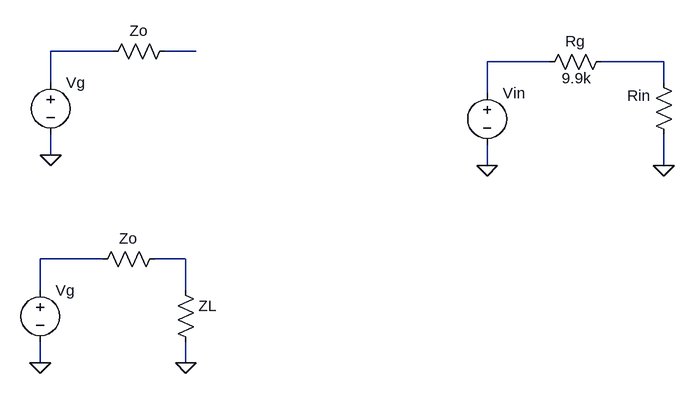
[diagram p0: schematic spice_imagenes.asc]
spice_imagenes.asc, the LTspice schematic file:
Version 4
SHEET 1 1060 680
WIRE 192 48 96 48
WIRE 320 48 272 48
WIRE 864 64 768 64
WIRE 1040 64 944 64
WIRE 96 96 96 48
WIRE 1040 96 1040 64
WIRE 768 112 768 64
WIRE 96 208 96 176
WIRE 768 224 768 192
WIRE 1040 224 1040 176
WIRE 176 368 80 368
WIRE 304 368 256 368
WIRE 80 416 80 368
WIRE 304 416 304 368
WIRE 80 528 80 496
WIRE 304 528 304 496
FLAG 96 208 0
FLAG 80 528 0
FLAG 304 528 0
FLAG 768 224 0
FLAG 1040 224 0
SYMBOL voltage 96 80 R0
WINDOW 123 0 0 Left 0
WINDOW 39 0 0 Left 0
SYMATTR InstName Vg
SYMATTR Value ""
SYMBOL res 288 32 R90
WINDOW 0 0 56 VBottom 2
WINDOW 3 32 56 VTop 2
SYMATTR InstName Zo
SYMATTR Value ""
SYMBOL voltage 80 400 R0
WINDOW 123 0 0 Left 0
WINDOW 39 0 0 Left 0
SYMATTR InstName Vg
SYMATTR Value ""
SYMBOL res 272 352 R90
WINDOW 0 0 56 VBottom 2
WINDOW 3 32 56 VTop 2
SYMATTR InstName Zo
SYMATTR Value ""
SYMBOL res 288 400 R0
SYMATTR InstName ZL
SYMATTR Value ""
SYMBOL voltage 768 96 R0
WINDOW 123 0 0 Left 0
WINDOW 39 0 0 Left 0
SYMATTR InstName Vin
SYMATTR Value ""
SYMBOL res 960 48 R90
WINDOW 0 0 56 VBottom 2
WINDOW 3 57 54 VBottom 2
SYMATTR InstName Rg
SYMATTR Value 9.9k
SYMBOL res 1056 192 R180
WINDOW 0 36 76 Left 2
WINDOW 3 36 40 Left 2
SYMATTR InstName Rin
SYMATTR Value ""

The netlist it stands for:
* spice_imagenes.asc
Vg N001 0
R§Zo N002 N001
Vg N005 0
R§Zo N006 N005
R§ZL N006 0
Vin N003 0
Rg N004 N003 9.9k
Rin 0 N004
.backanno
.end